# EasyEDA schematic BIT 4.json
TITLE: TRICORE | ALU | CMP; REV: 1.0; Date: 2022-01-05; Sheet: 4/8; Drawn By: Koehler, Paul; Company: komed3
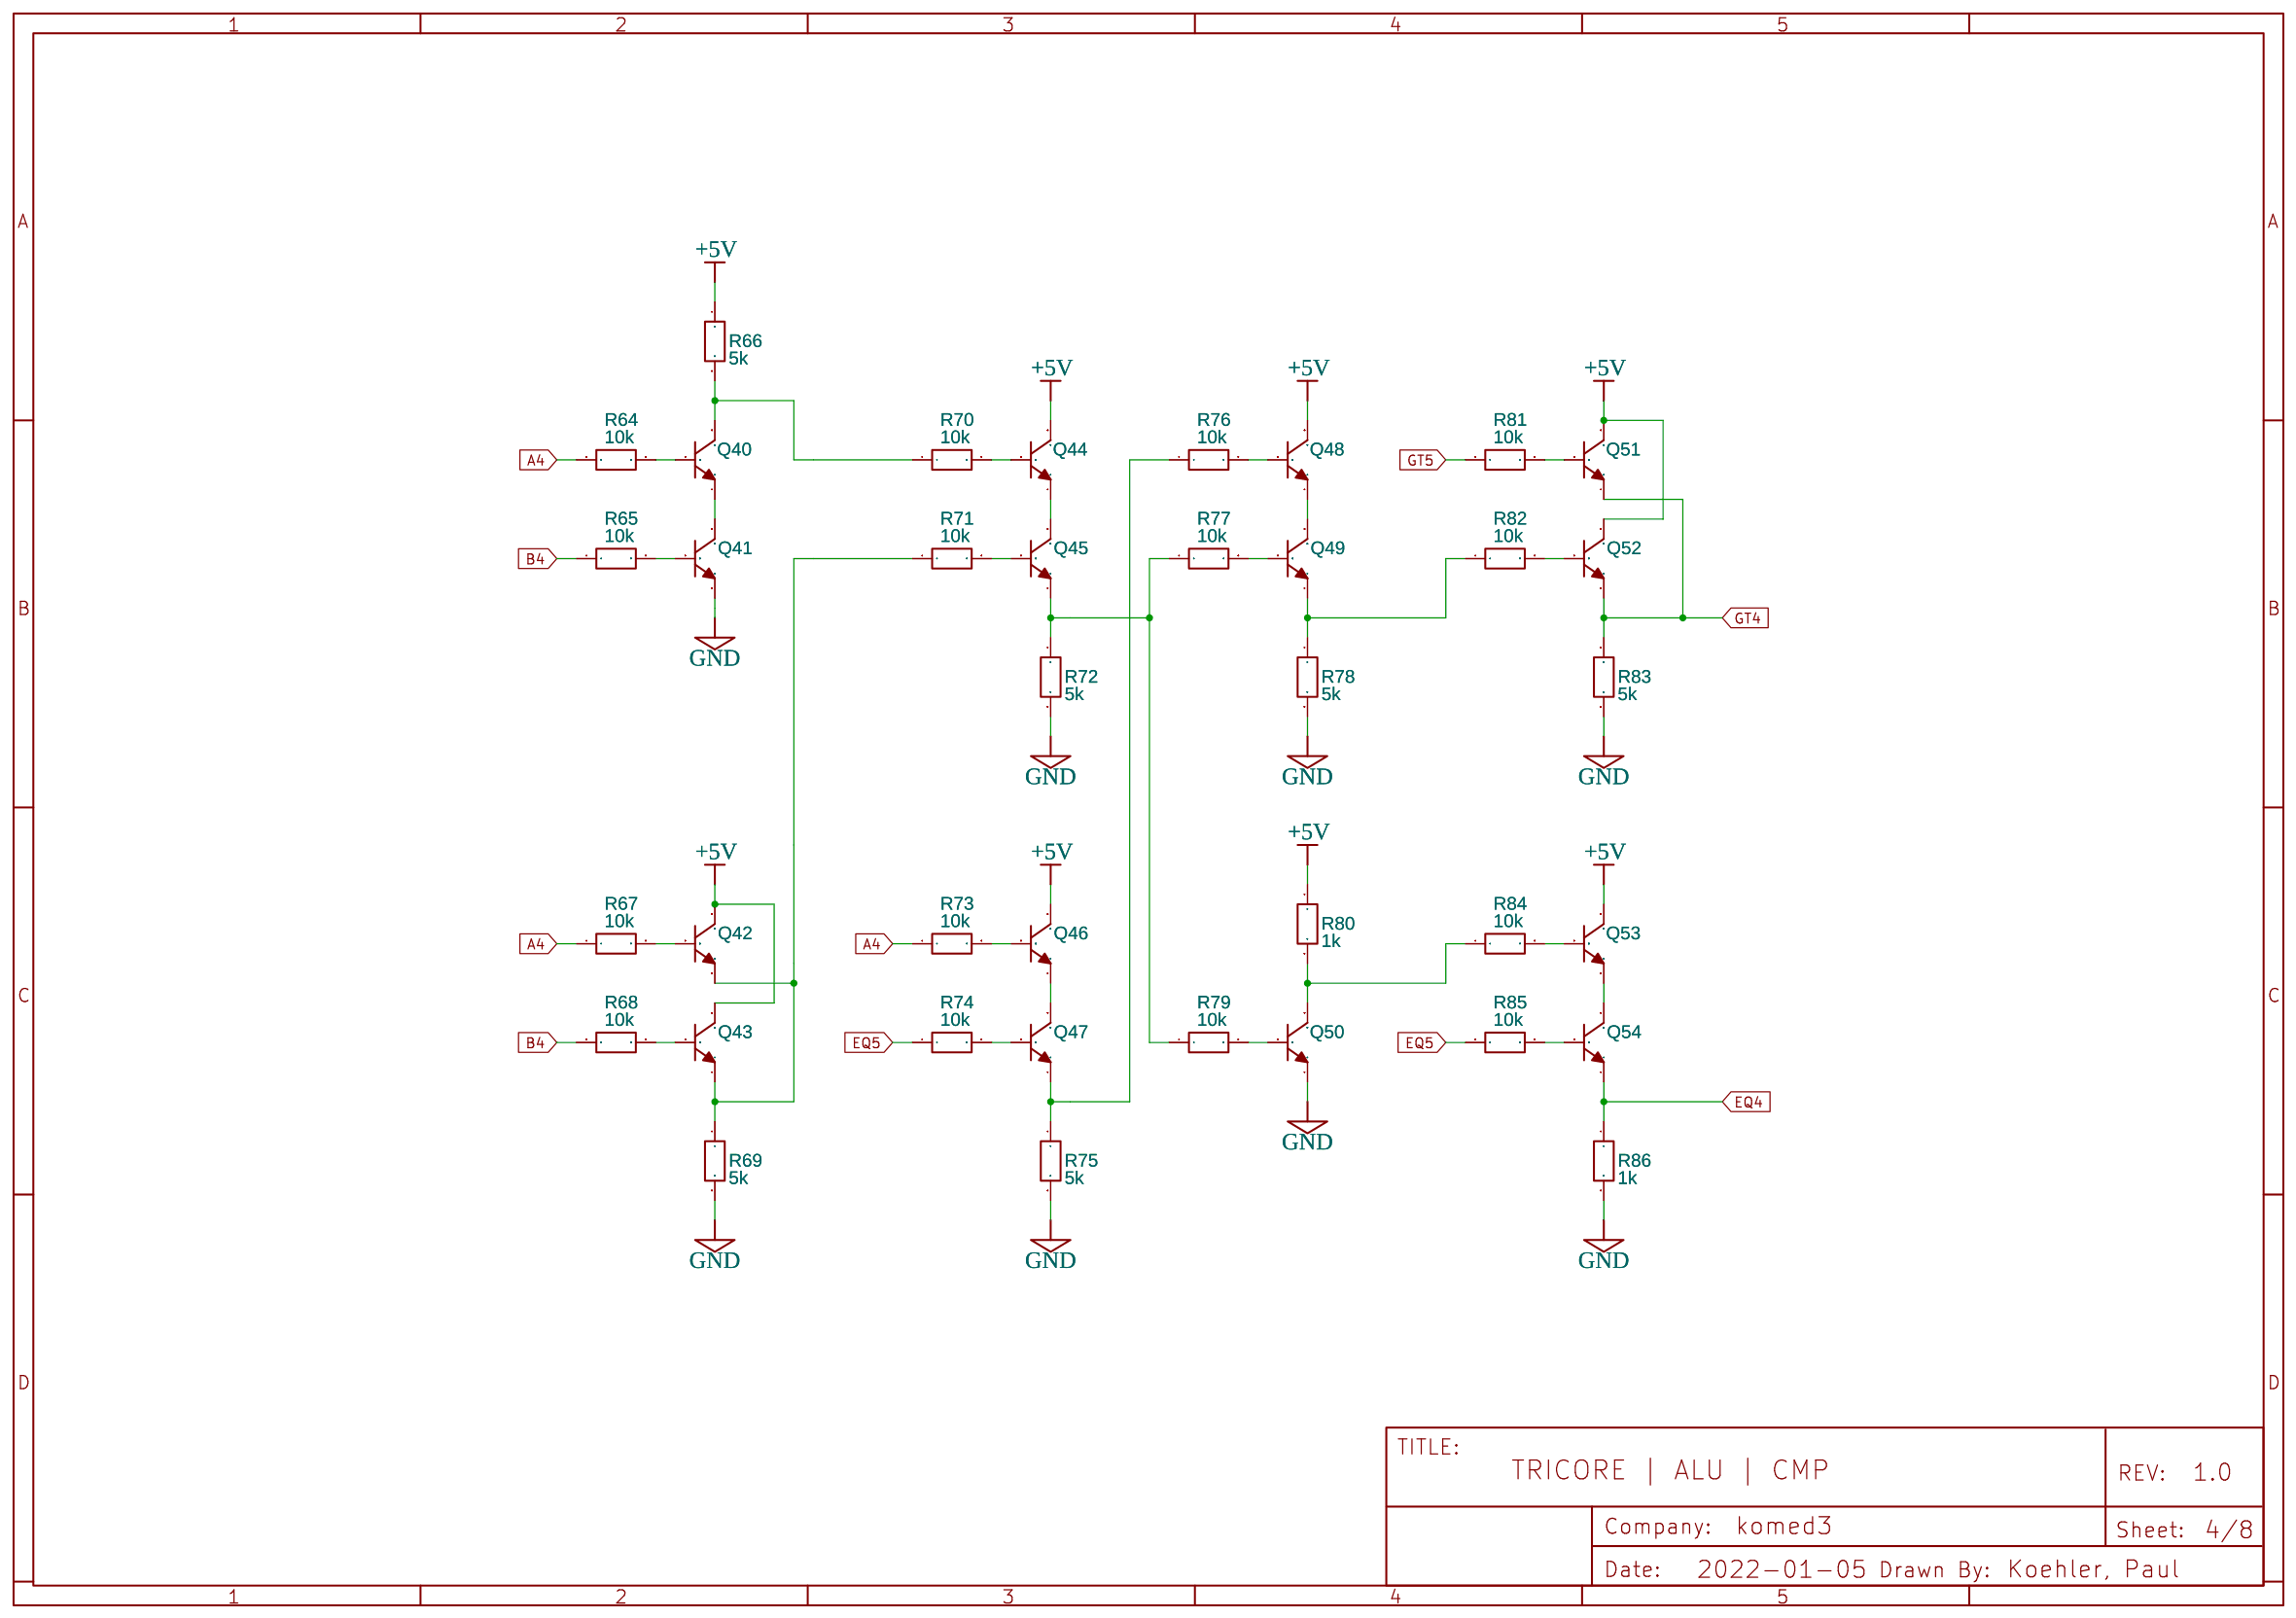
[diagram p0: schematic sheet]

## Parts
Q40  2N3904(TO-92)  [TO-92-3_L5.1-W4.1-P1.27-L]
Q41  2N3904(TO-92)  [TO-92-3_L5.1-W4.1-P1.27-L]
Q42  2N3904(TO-92)  [TO-92-3_L5.1-W4.1-P1.27-L]
Q43  2N3904(TO-92)  [TO-92-3_L5.1-W4.1-P1.27-L]
Q44  2N3904(TO-92)  [TO-92-3_L5.1-W4.1-P1.27-L]
Q45  2N3904(TO-92)  [TO-92-3_L5.1-W4.1-P1.27-L]
Q46  2N3904(TO-92)  [TO-92-3_L5.1-W4.1-P1.27-L]
Q47  2N3904(TO-92)  [TO-92-3_L5.1-W4.1-P1.27-L]
Q48  2N3904(TO-92)  [TO-92-3_L5.1-W4.1-P1.27-L]
Q49  2N3904(TO-92)  [TO-92-3_L5.1-W4.1-P1.27-L]
Q50  2N3904(TO-92)  [TO-92-3_L5.1-W4.1-P1.27-L]
Q51  2N3904(TO-92)  [TO-92-3_L5.1-W4.1-P1.27-L]
Q52  2N3904(TO-92)  [TO-92-3_L5.1-W4.1-P1.27-L]
Q53  2N3904(TO-92)  [TO-92-3_L5.1-W4.1-P1.27-L]
Q54  2N3904(TO-92)  [TO-92-3_L5.1-W4.1-P1.27-L]
R64  10k  [R_AXIAL-0.3]
R65  10k  [R_AXIAL-0.3]
R66  5k  [R_AXIAL-0.3]
R67  10k  [R_AXIAL-0.3]
R68  10k  [R_AXIAL-0.3]
R69  5k  [R_AXIAL-0.3]
R70  10k  [R_AXIAL-0.3]
R71  10k  [R_AXIAL-0.3]
R72  5k  [R_AXIAL-0.3]
R73  10k  [R_AXIAL-0.3]
R74  10k  [R_AXIAL-0.3]
R75  5k  [R_AXIAL-0.3]
R76  10k  [R_AXIAL-0.3]
R77  10k  [R_AXIAL-0.3]
R78  5k  [R_AXIAL-0.3]
R79  10k  [R_AXIAL-0.3]
R80  1k  [R_AXIAL-0.3]
R81  10k  [R_AXIAL-0.3]
R82  10k  [R_AXIAL-0.3]
R83  5k  [R_AXIAL-0.3]
R84  10k  [R_AXIAL-0.3]
R85  10k  [R_AXIAL-0.3]
R86  1k  [R_AXIAL-0.3]

## Library data of the parts
Q40-Q54 = 2N3904(TO-92): Supplier: LCSC; Manufacturer: SEMTECH; Manufacturer Part: 2N3904; Supplier Part: C118538; Contributor: LCEDA_Lib
R64-R86 = R_AXIAL-0.3_EU: Contributor: LCEDA_Lib

## Nets
+5V: Q42.3(C) Q43.3(C) Q44.3(C) Q46.3(C) Q48.3(C) Q51.3(C) Q52.3(C) Q53.3(C) R66.1 R80.1
GND: Q41.1(E) Q50.1(E) R69.2 R72.2 R75.2 R78.2 R83.2 R86.2
A4: R64.1 R67.1 R73.1
B4: R65.1 R68.1
EQ4: Q54.1(E) R86.1
EQ5: R74.1 R85.1
GT4: Q51.1(E) Q52.1(E) R83.1
GT5: R81.1
Net-(Q40-1): Q40.1(E) Q41.3(C)
Net-(Q40-2): Q40.2(B) R64.2
Net-(Q40-3): Q40.3(C) R66.2 R70.1
Net-(Q41-2): Q41.2(B) R65.2
Net-(Q42-1): Q42.1(E) Q43.1(E) R69.1 R71.1
Net-(Q42-2): Q42.2(B) R67.2
Net-(Q43-2): Q43.2(B) R68.2
Net-(Q44-1): Q44.1(E) Q45.3(C)
Net-(Q44-2): Q44.2(B) R70.2
Net-(Q45-1): Q45.1(E) R72.1 R77.1 R79.1
Net-(Q45-2): Q45.2(B) R71.2
Net-(Q46-1): Q46.1(E) Q47.3(C)
Net-(Q46-2): Q46.2(B) R73.2
Net-(Q47-1): Q47.1(E) R75.1 R76.1
Net-(Q47-2): Q47.2(B) R74.2
Net-(Q48-1): Q48.1(E) Q49.3(C)
Net-(Q48-2): Q48.2(B) R76.2
Net-(Q49-1): Q49.1(E) R78.1 R82.1
Net-(Q49-2): Q49.2(B) R77.2
Net-(Q50-2): Q50.2(B) R79.2
Net-(Q50-3): Q50.3(C) R80.2 R84.1
Net-(Q51-2): Q51.2(B) R81.2
Net-(Q52-2): Q52.2(B) R82.2
Net-(Q53-1): Q53.1(E) Q54.3(C)
Net-(Q53-2): Q53.2(B) R84.2
Net-(Q54-2): Q54.2(B) R85.2
